# Altium schematic sheet 气压传感器模块应用原理图.SchDoc
size A4
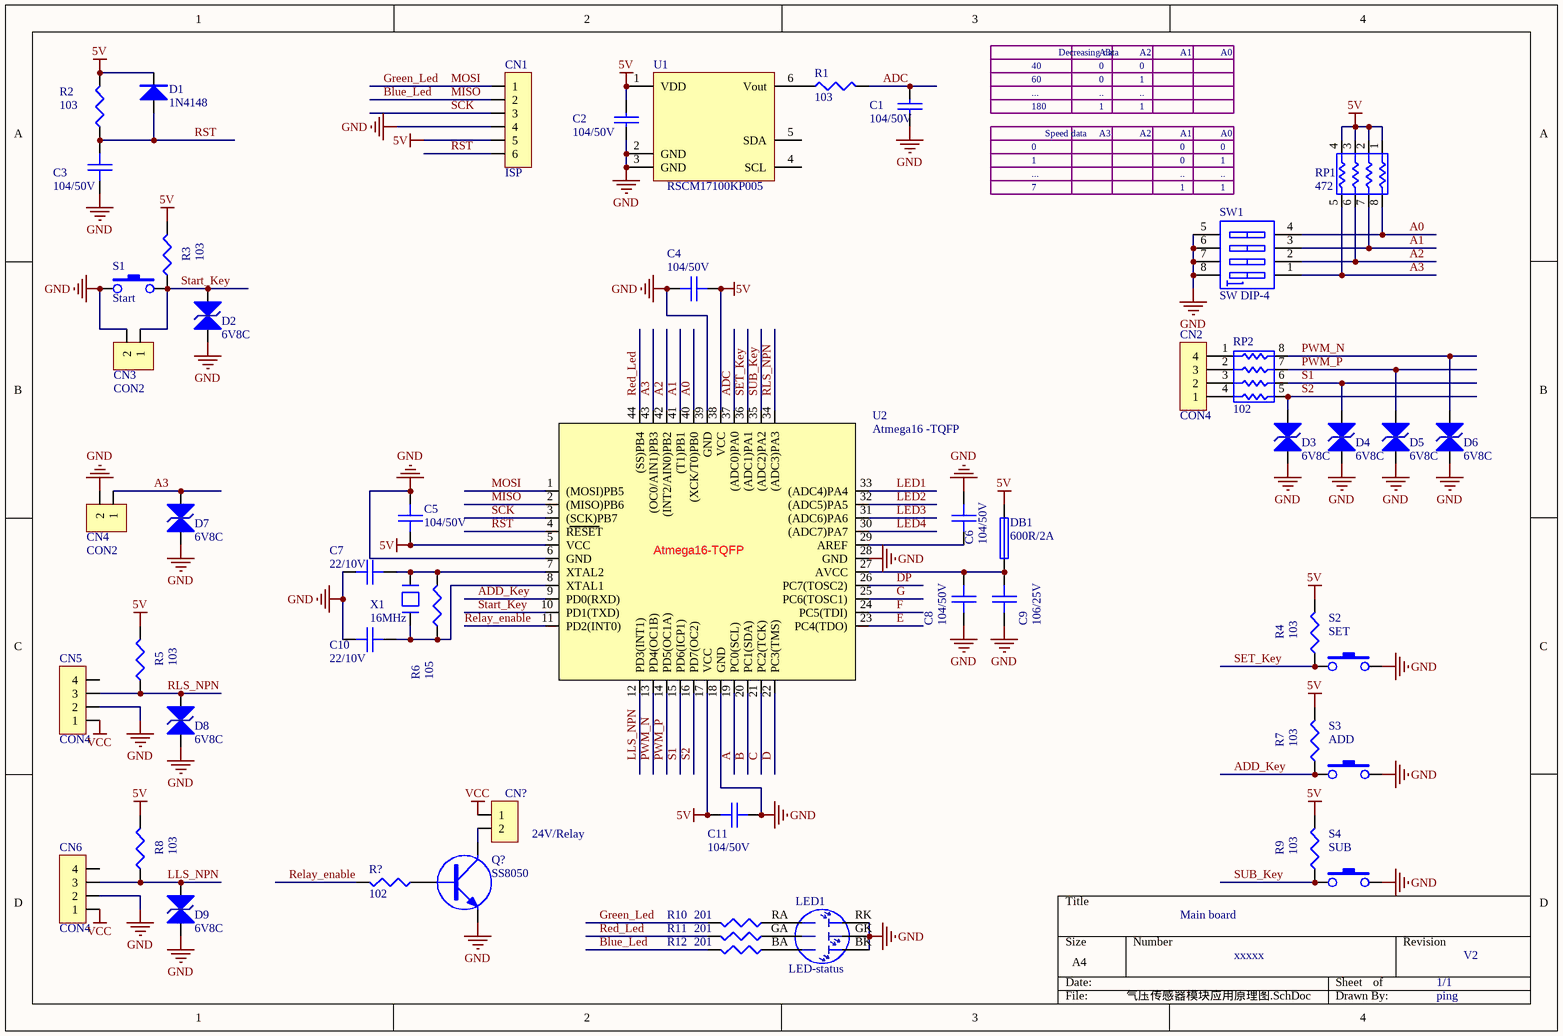
[diagram p0: 气压传感器模块应用原理图.SchDoc]

## Parts
C1  104/50V  [0603C]
C2  104/50V  [0603C]
C3  104/50V  [0603C]
C4  104/50V  [0603C]
C5  104/50V  [0603C]
C6  104/50V  [0603C]
C7  22/10V  [0603C]
C8  104/50V  [0603C]
C9  106/25V  [0805C]
C10  22/10V  [0603C]
C11  104/50V  [0603C]
CN1  ISP  [SIP3x2-2.0]
CN2  CON4  [CON4-5.08]
CN3  CON2  [CON2-5.08]
CN4  CON2  [CON2-5.08]
CN5  CON4  [CON4-5.08]
CN6  CON4  [CON4-5.08]
CN?  24V/Relay  [CON2-5.08]
D1  1N4148  [1206D]
D2  6V8C  [TVS-SMBJ30CA]
D3  6V8C  [TVS-SMBJ30CA]
D4  6V8C  [TVS-SMBJ30CA]
D5  6V8C  [TVS-SMBJ30CA]
D6  6V8C  [TVS-SMBJ30CA]
D7  6V8C  [TVS-SMBJ30CA]
D8  6V8C  [TVS-SMBJ30CA]
D9  6V8C  [TVS-SMBJ30CA]
DB1  600R/2A  [0805L]
LED1  LED-status  [LED-RGB-6]
Q?  SS8050  [SOT-23]
R1  103  [0603R]
R2  103  [0603R]
R3  103  [0603R]
R4  103  [0603R]
R5  103  [0603R]
R6  105  [0603R]
R7  103  [0603R]
R8  103  [0603R]
R9  103  [0603R]
R10  201  [0603R]
R11  201  [0603R]
R12  201  [0603R]
R?  102  [0603R]
RP1  472  [0603-8P4R]
RP2  102  [0603-8P4R]
S1  Start  [KB7-12*12]
S2  SET  [KB7-12*12]
S3  ADD  [KB7-12*12]
S4  SUB  [KB7-12*12]
SW1  SW DIP-4  [SW-DIP-4]
U1  RSCM17100KP005  [RSCM17100Kxxxx-A]
U2  Atmega16 -TQFP  [QFP44]
X1  16MHz  [3225-X]

## Nets
5V: C2.1 C4.2 C5.1 C11.1 CN1.5 D1.K DB1.1 R2.2 R3.2 R4.2 R5.2 R7.2 R8.2 R9.2 RP1.1 RP1.2 RP1.3 RP1.4 U1.1(VDD) U2.5(VCC) U2.17(VCC) U2.38(VCC)
GND: C1.1 C2.2 C3.1 C4.1 C5.2 C6.1 C7.2 C8.2 C9.2 C10.2 C11.2 CN1.4 CN3.2 CN4.2 CN5.2 CN6.2 D2.2 D3.2 D4.2 D5.2 D6.2 D7.2 D8.2 D9.2 LED1.BK LED1.GK LED1.RK Q?.E S1.1 S2.2 S3.2 S4.2 SW1.5(B4) SW1.6(B3) SW1.7(B2) SW1.8(B1) U1.2(GND) U1.3(GND) U2.6(GND) U2.18(GND) U2.28(GND) U2.39(GND)
VCC: CN5.1 CN6.1 CN?.1
A: U2.19(PC0(SCL))
A0: RP1.8 SW1.4(A4) U2.40((XCK/T0)PB0)
A1: RP1.7 SW1.3(A3) U2.41((T1)PB1)
A2: RP1.6 SW1.2(A2) U2.42((INT2/AIN0)PB2)
A3: CN4.1 D7.1 RP1.5 SW1.1(A1) U2.43((OC0/AIN1)PB3)
ADC: C1.2 R1.2 U2.37((ADC0)PA0)
ADD_Key: R7.1 S3.1 U2.9(PD0(RXD))
B: U2.20(PC1(SDA))
Blue_Led: CN1.2 R12.2 U2.2((MISO)PB6)  [also labelled MISO]
C: U2.21(PC2(TCK))
D: U2.22(PC3(TMS))
DP: U2.26(PC7(TOSC2))
E: U2.23(PC4(TDO))
F: U2.24(PC5(TDI))
G: U2.25(PC6(TOSC1))
Green_Led: CN1.1 R10.2 U2.1((MOSI)PB5)  [also labelled MOSI]
LED1: U2.33((ADC4)PA4)
LED2: U2.32((ADC5)PA5)
LED3: U2.31((ADC6)PA6)
LED4: U2.30((ADC7)PA7)
LLS_NPN: CN6.3 D9.1 R8.1 U2.12(PD3(INT1))
PWM_N: D6.1 RP2.8 U2.13(PD4(OC1B))
PWM_P: D5.1 RP2.7 U2.14(PD5(OC1A))
Red_Led: R11.2 U2.44((SS)PB4)
Relay_enable: R?.2 U2.11(PD2(INT0))
RLS_NPN: CN5.3 D8.1 R5.1 U2.34((ADC3)PA3)
RST: C3.2 CN1.6 D1.A R2.1 U2.4(RESET)
S1: D4.1 RP2.6 U2.15(PD6(ICP1))
S2: D3.1 RP2.5 U2.16(PD7(OC2))
SCK: CN1.3 U2.3((SCK)PB7)
SET_Key: R4.1 S2.1 U2.36((ADC1)PA1)
Start_Key: CN3.1 D2.1 R3.1 S1.2 U2.10(PD1(TXD))
SUB_Key: R9.1 S4.1 U2.35((ADC2)PA2)
NetC6_2: C6.2 U2.29(AREF)
NetC7_1: C7.1 R6.2 U2.7(XTAL2) X1.2
NetC8_1: C8.1 C9.1 DB1.2 U2.27(AVCC)
NetC10_1: C10.1 R6.1 U2.8(XTAL1) X1.1
NetCN2_1: CN2.1 RP2.4
NetCN2_2: CN2.2 RP2.3
NetCN2_3: CN2.3 RP2.2
NetCN2_4: CN2.4 RP2.1
NetCN?_2: CN?.2 Q?.C
NetLED1_BA: LED1.BA R12.1
NetLED1_GA: LED1.GA R11.1
NetLED1_RA: LED1.RA R10.1
NetQ?_B: Q?.B R?.1
NetR1_1: R1.1 U1.6(Vout)

Not connected (* = marked no-connect by the designer): CN5 4; CN6 4; U1 4(SCL) 5(SDA)

## Notes on the sheet
- ...
- 40
- 60
- 180
- Decreasing data
- A3
- 0
- ..
- 1
- A2
- A1
- A0
- Speed data
- 7
- (near SW1) 1
- Main board
- xxxxx
- 1/1
- V2
- ping
- (in symbol Atmega16 -TQFP) Atmega16-TQFP

## Library data of the parts
C1-C11 = CAP: Capacitor
CN1 = CON6: Connector
CN2 CN5 CN6 = CON4: Connector
CN3 CN4 CN? = CON2: Connector
D1 = DIODE
D2-D9 = TVS: Diode
DB1 = DB
LED1 = LED RGB_2
Q? = NPN_1: NPN Transistor
R1-R12 R? = RES1_1
RP1 RP2 = RESPACK4-1
S1-S4 = SW-PB
SW1 = SW DIP-4: DIP Switch
U1 = RSCM17100Kxxxx
X1 = CRYSTAL